# EAGLE schematic mb808909seq1.9 (EAGLE 6.5.0)
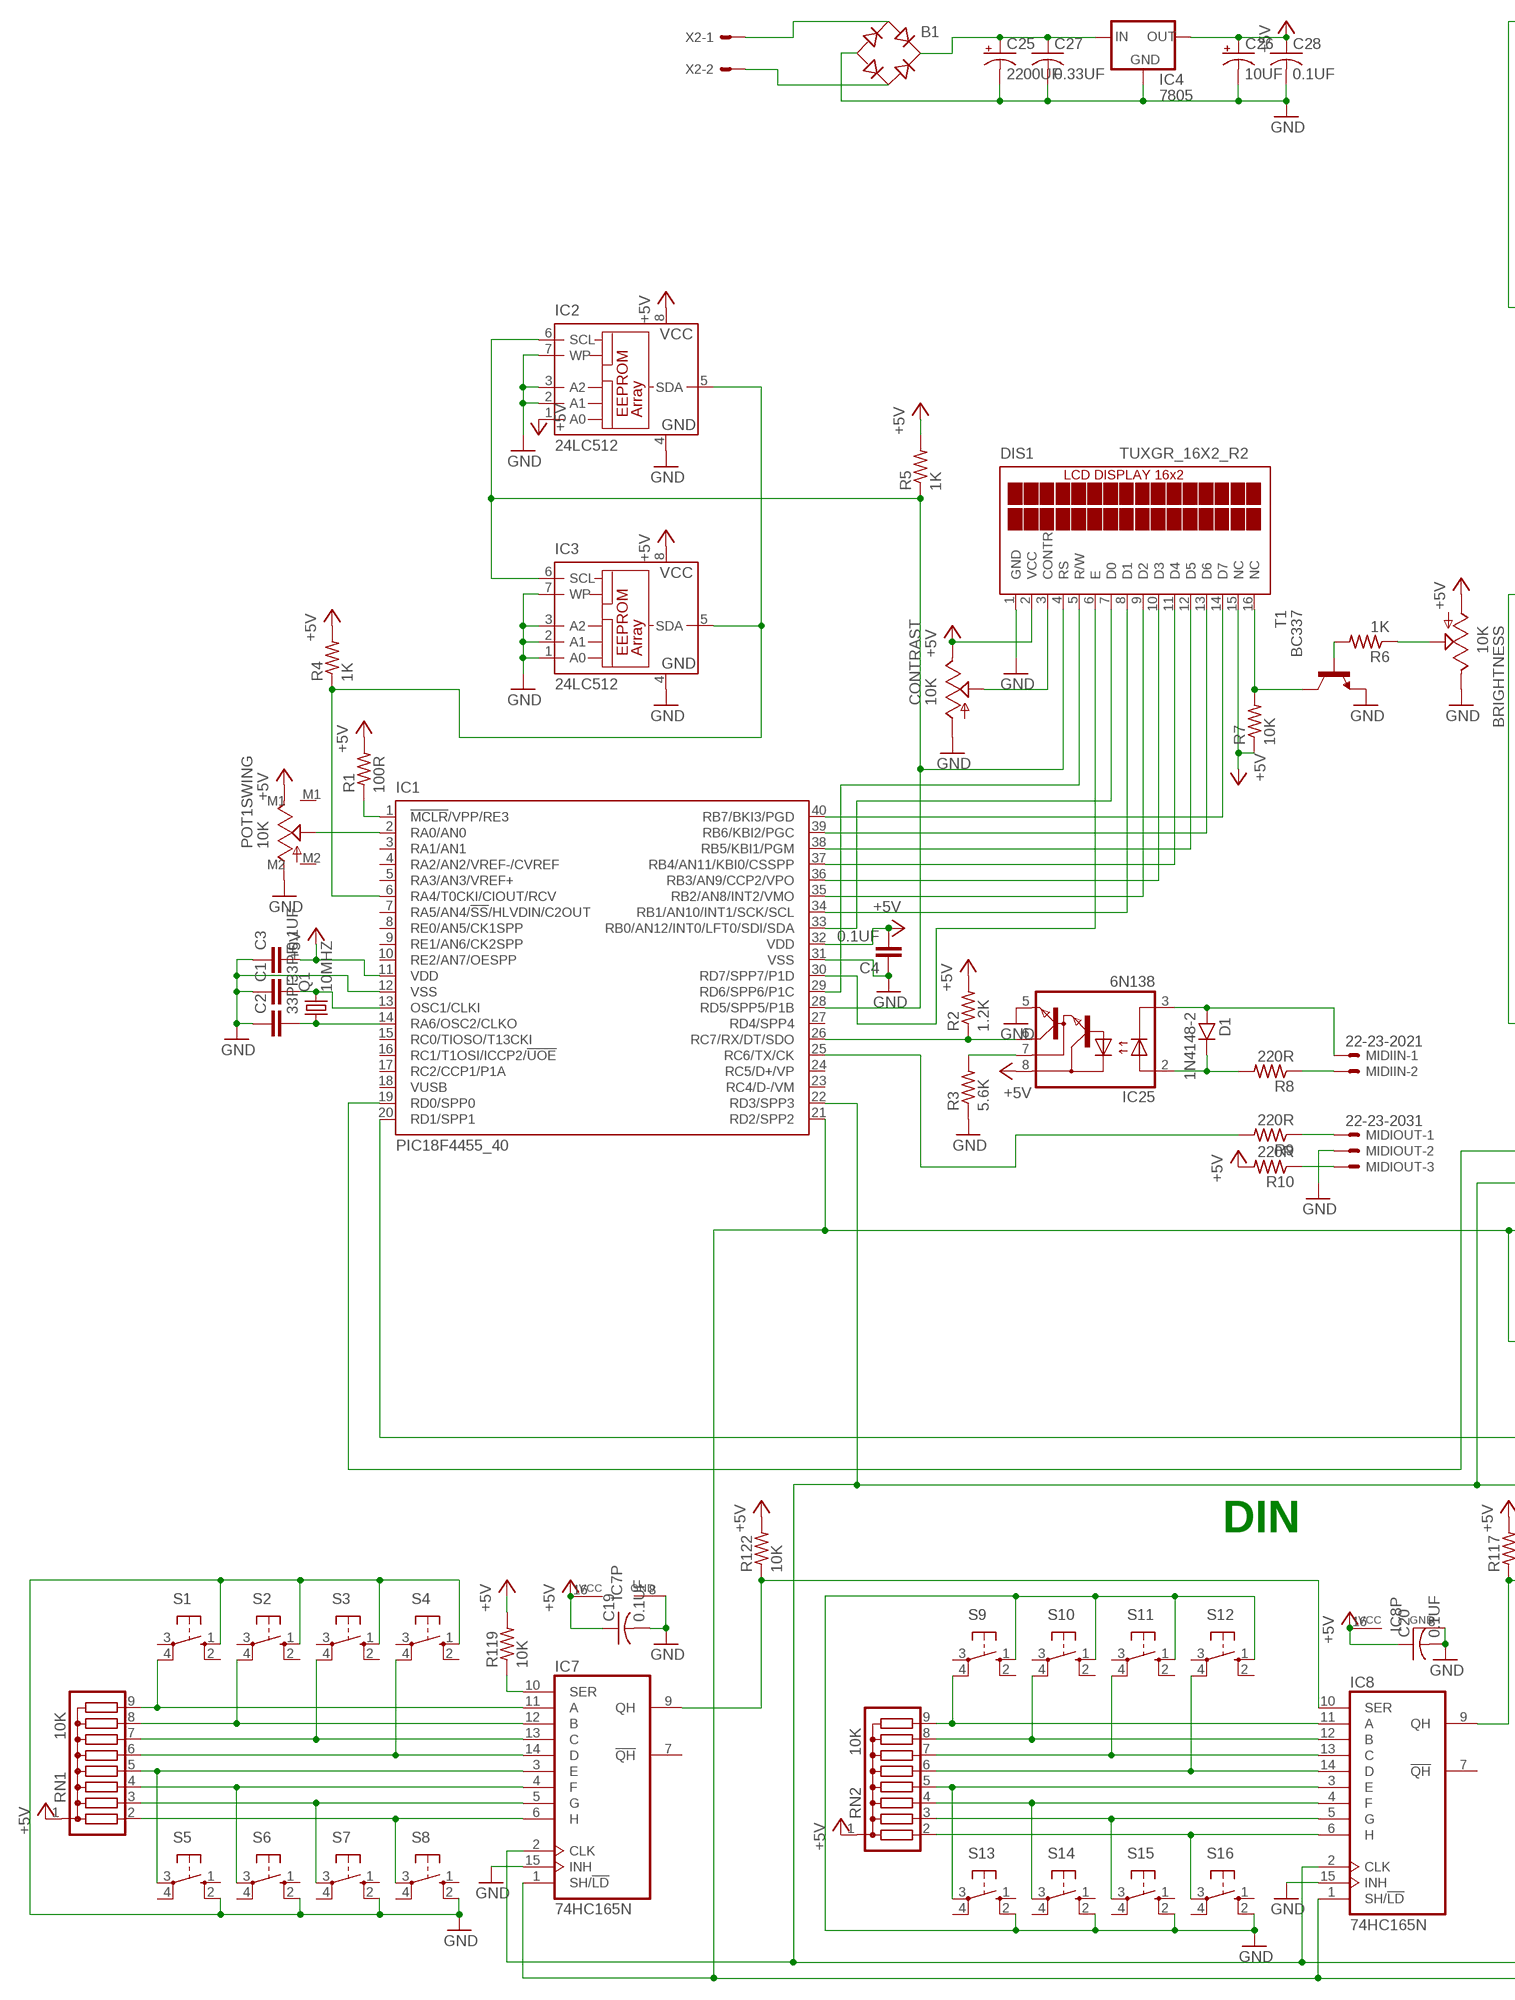
[diagram p0: schematic, sheet 1, part 1 of 2]
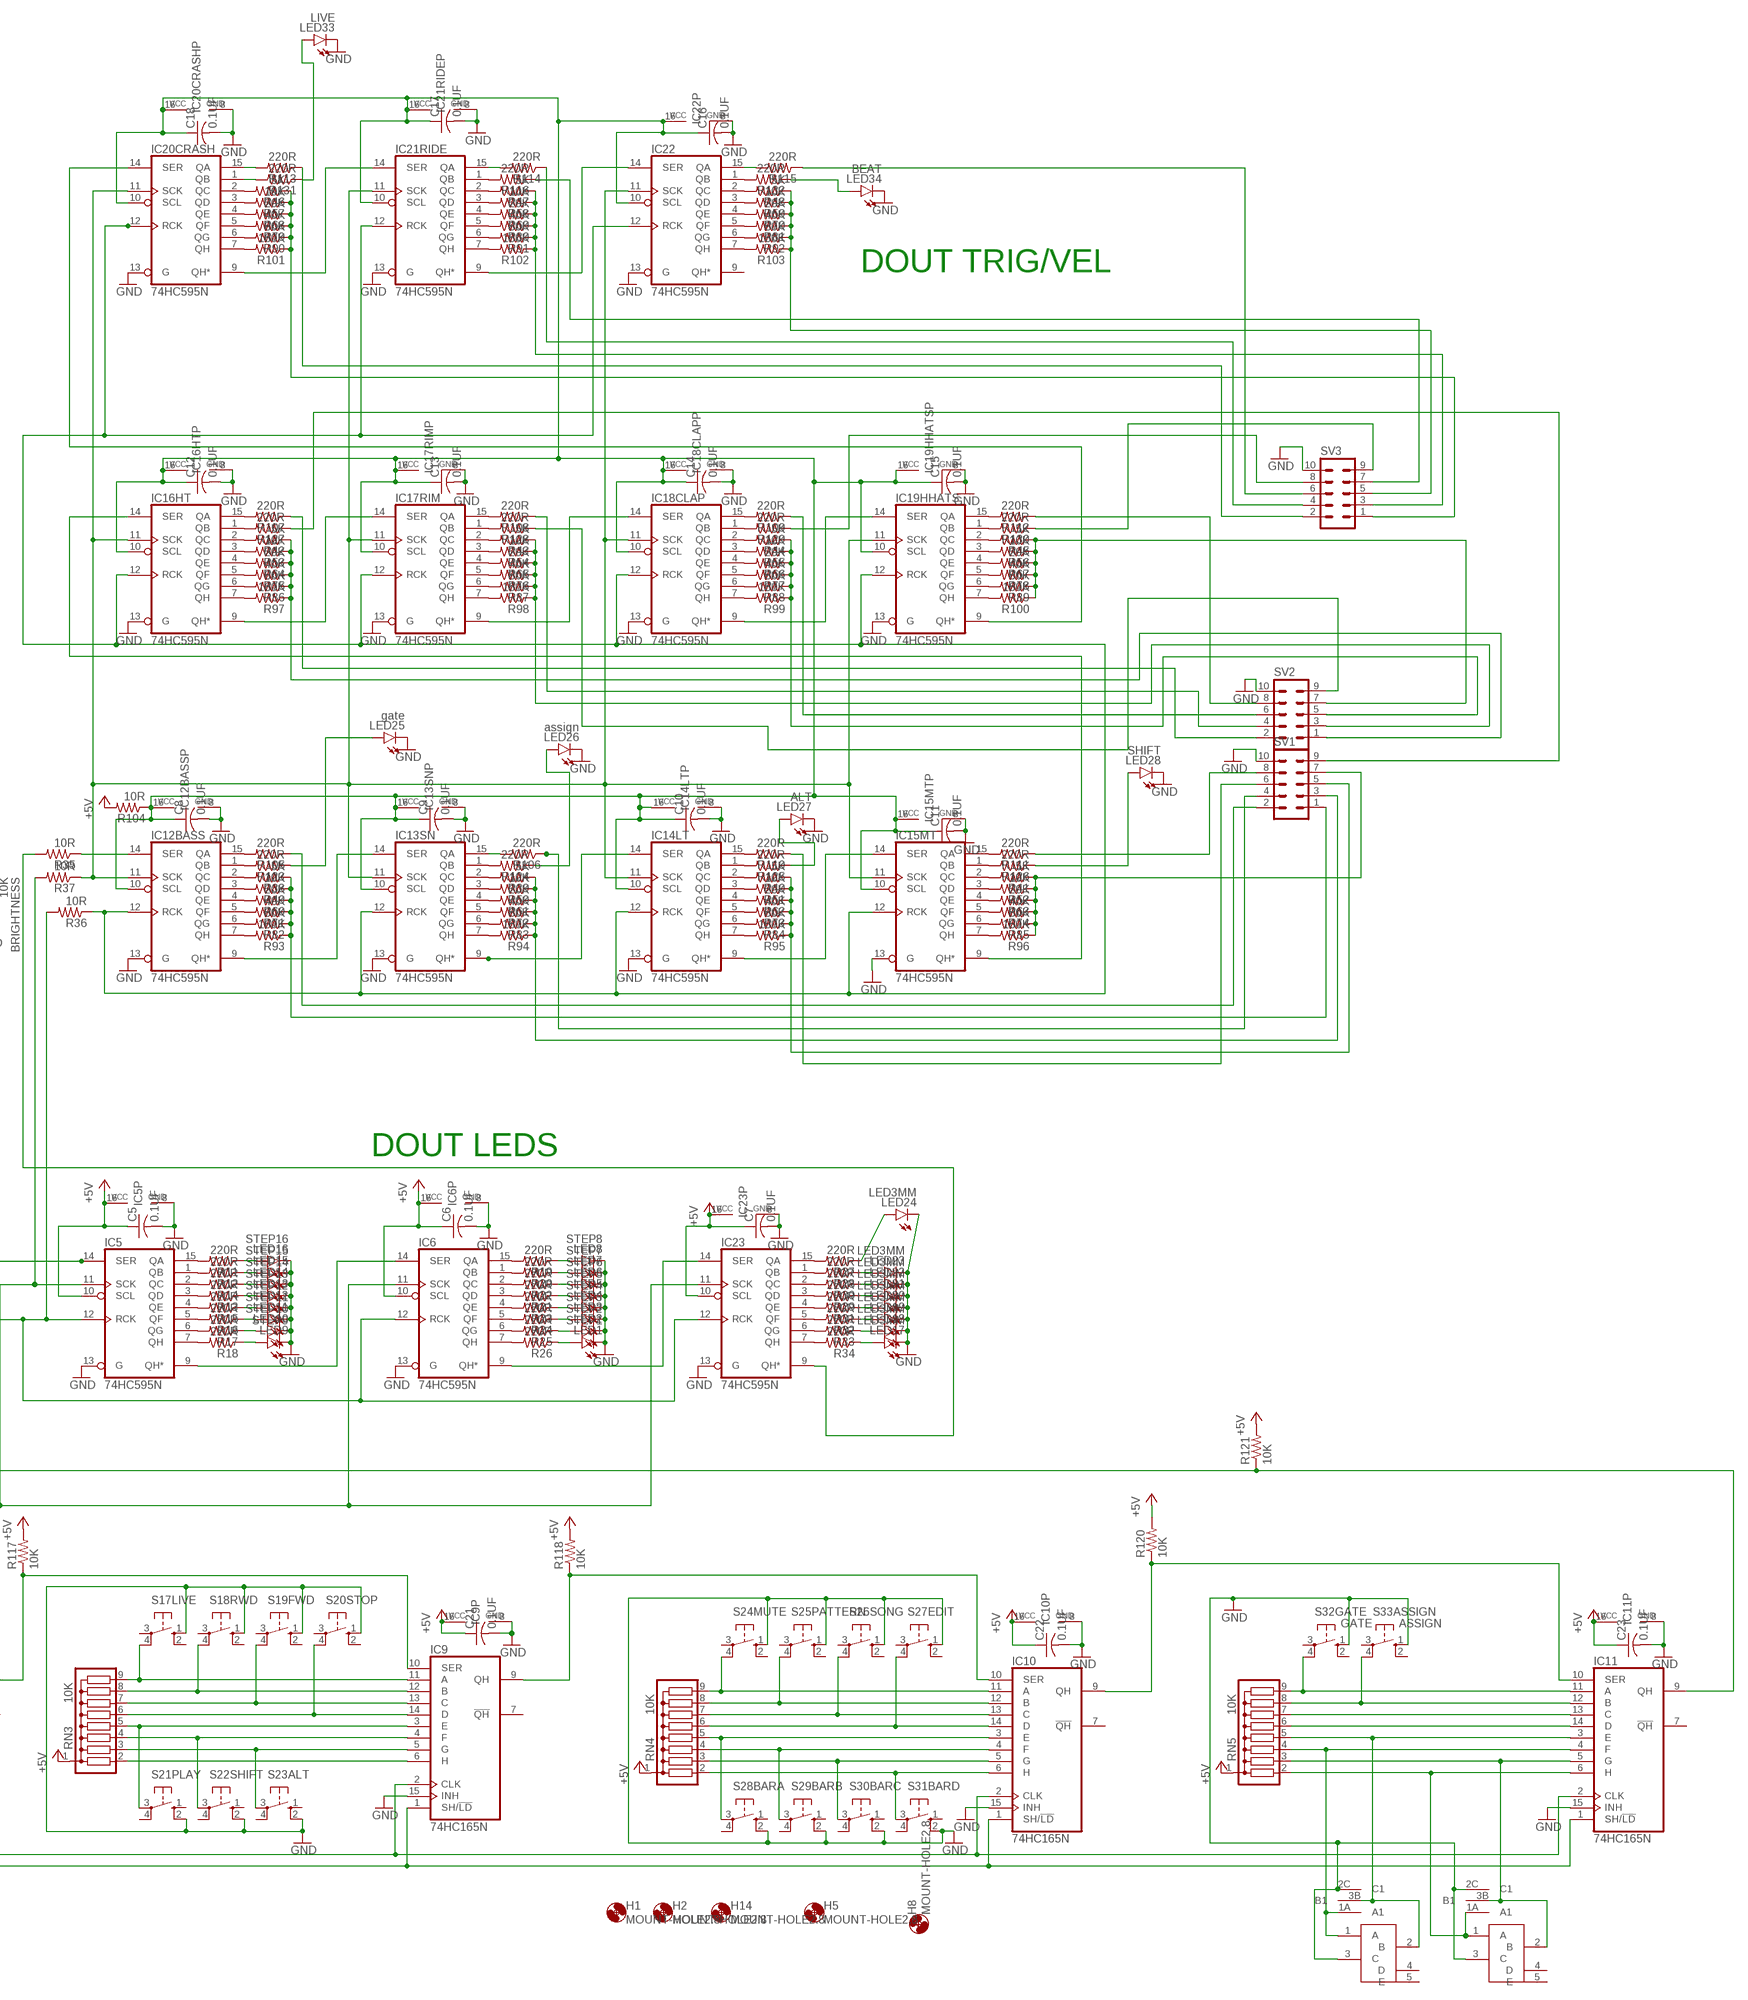
[diagram p1: schematic, sheet 1, part 2 of 2]

## Parts
B1  RB1A  [RB1A]
BRIGHTNESS  10K  TRIM_US-CA6V  [CA6V]
C1  33PF  050X030_0251  [050X030_025]
C2  33PF  050X030_0251  [050X030_025]
C3  0.1UF  050X030_0252  [050X030_025_2]
C4  0.1UF  050X030_0252  [050X030_025_2]
C5  0.1UF  C-US025-025X050  [C025-025X050]
C6  0.1UF  C-US025-025X050  [C025-025X050]
C7  0.1UF  C-US025-025X050  [C025-025X050]
C8  0.1UF  C-US025-025X050  [C025-025X050]
C9  0.1UF  C-US025-025X050  [C025-025X050]
C10  0.1UF  C-US025-025X050  [C025-025X050]
C11  0.1UF  C-US025-025X050  [C025-025X050]
C12  0.1UF  C-US025-025X050  [C025-025X050]
C13  0.1UF  C-US025-025X050  [C025-025X050]
C14  0.1UF  C-US025-025X050  [C025-025X050]
C15  0.1UF  C-US025-025X050  [C025-025X050]
C16  0.1UF  C-US025-025X050  [C025-025X050]
C17  0.1UF  C-US025-025X050  [C025-025X050]
C18  0.1UF  C-US025-025X050  [C025-025X050]
C19  0.1UF  C-US025-025X050  [C025-025X050]
C20  0.1UF  C-US025-025X050  [C025-025X050]
C21  0.1UF  C-US025-025X050  [C025-025X050]
C22  0.1UF  C-US025-025X050  [C025-025X050]
C23  0.1UF  C-US025-025X050  [C025-025X050]
C25  2200UF  CPOL-USE5-13  [E5-13]
C26  10UF  CPOL-USE2.5-5  [E2,5-5]
C27  0.33UF  C-US050-035X075  [C050-035X075]
C28  0.1UF  C-US025-025X050  [C025-025X050]
CONTRAST  10K  TRIM_US-CA6V  [CA6V]
D1  1N4148-2  [DO35-2]
DIS1  TUXGR_16X2_R2  [TUXGR_16X2_R2]
ENC1  instrument select  808_SNAPIN-ENCODER2  [808_SNAPIN]
ENC2  tempo  808_SNAPIN-ENCODER2  [808_SNAPIN]
H1  MOUNT-HOLE2.8  [2,8]
H2  MOUNT-HOLE2.8  [2,8]
H5  MOUNT-HOLE2.8  [2,8]
H8  MOUNT-HOLE2.8  [2,8]
H14  MOUNT-HOLE2.8  [2,8]
IC1  PIC18F4455_40  [DIL40]
IC2  24LC512  24C04P  [DIL8]
IC3  24LC512  24C04P  [DIL8]
IC4  7805  78XXS  [78XXS]
IC5  74HC595N  [DIL16]
IC6  74HC595N  [DIL16]
IC7  74HC165N  [DIL16]
IC8  74HC165N  [DIL16]
IC9  74HC165N  [DIL16]
IC10  74HC165N  [DIL16]
IC11  74HC165N  [DIL16]
IC12BASS  74HC595N  [DIL16]
IC13SN  74HC595N  [DIL16]
IC14LT  74HC595N  [DIL16]
IC15MT  74HC595N  [DIL16]
IC16HT  74HC595N  [DIL16]
IC17RIM  74HC595N  [DIL16]
IC18CLAP  74HC595N  [DIL16]
IC19HHATS  74HC595N  [DIL16]
IC20CRASH  74HC595N  [DIL16]
IC21RIDE  74HC595N  [DIL16]
IC22  74HC595N  [DIL16]
IC23  74HC595N  [DIL16]
IC25  6N138  [DIL08]
LED1  STEP1  LED3MM  [LED3MM]
LED2  STEP2  LED3MM  [LED3MM]
LED3  STEP3  LED3MM  [LED3MM]
LED4  STEP4  LED3MM  [LED3MM]
LED5  STEP5  LED3MM  [LED3MM]
LED6  STEP6  LED3MM  [LED3MM]
LED7  STEP7  LED3MM  [LED3MM]
LED8  STEP8  LED3MM  [LED3MM]
LED9  STEP9  LED3MM  [LED3MM]
LED10  STEP10  LED3MM  [LED3MM]
LED11  STEP11  LED3MM  [LED3MM]
LED12  STEP12  LED3MM  [LED3MM]
LED13  STEP13  LED3MM  [LED3MM]
LED14  STEP14  LED3MM  [LED3MM]
LED15  STEP15  LED3MM  [LED3MM]
LED16  STEP16  LED3MM  [LED3MM]
LED17  LED3MM  [LED3MM]
LED18  LED3MM  [LED3MM]
LED19  LED3MM  [LED3MM]
LED20  LED3MM  [LED3MM]
LED21  LED3MM  [LED3MM]
LED22  LED3MM  [LED3MM]
LED23  LED3MM  [LED3MM]
LED24  LED3MM  [LED3MM]
LED25  gate  LED3MM  [LED3MM]
LED26  assign  LED3MM  [LED3MM]
LED27  ALT  LED3MM  [LED3MM]
LED28  SHIFT  LED3MM  [LED3MM]
LED33  LIVE  LED3MM  [LED3MM]
LED34  BEAT  LED3MM  [LED3MM]
MIDIIN  22-23-2021  [22-23-2021]
MIDIOUT  22-23-2031  [22-23-2031]
POT1SWING  10K  303PARTS_POTEVU  [303PARTS_EVU]
Q1  10MHZ  CRYSTALHC18U-V  [HC18U-V]
R1  100R  6MM.3  [R0207/3]
R2  1.2K  6MM.3  [R0207/3]
R3  5.6K  6MM.3  [R0207/3]
R4  1K  6MM.3  [R0207/3]
R5  1K  6MM.3  [R0207/3]
R6  1K  6MM.3  [R0207/3]
R7  10K  6MM.3  [R0207/3]
R8  220R  6MM.3  [R0207/3]
R9  220R  6MM.3  [R0207/3]
R10  220R  6MM.3  [R0207/3]
R11  220R  6MM.3  [R0207/3]
R12  220R  6MM.3  [R0207/3]
R13  220R  6MM.3  [R0207/3]
R14  220R  6MM.3  [R0207/3]
R15  220R  6MM.3  [R0207/3]
R16  220R  6MM.3  [R0207/3]
R17  220R  6MM.3  [R0207/3]
R18  220R  6MM.3  [R0207/3]
R19  220R  6MM.3  [R0207/3]
R20  220R  6MM.3  [R0207/3]
R21  220R  6MM.3  [R0207/3]
R22  220R  6MM.3  [R0207/3]
R23  220R  6MM.3  [R0207/3]
R24  220R  6MM.3  [R0207/3]
R25  220R  6MM.3  [R0207/3]
R26  220R  6MM.3  [R0207/3]
R27  220R  6MM.3  [R0207/3]
R28  220R  6MM.3  [R0207/3]
R29  220R  6MM.3  [R0207/3]
R30  220R  6MM.3  [R0207/3]
R31  220R  6MM.3  [R0207/3]
R32  220R  6MM.3  [R0207/3]
R33  220R  6MM.3  [R0207/3]
R34  220R  6MM.3  [R0207/3]
R35  10R  6MM.3  [R0207/3]
R36  10R  6MM.3  [R0207/3]
R37  10R  6MM.3  [R0207/3]
R38  5K  6MM.3  [R0207/3]
R39  5K  6MM.3  [R0207/3]
R40  5K  6MM.3  [R0207/3]
R41  5K  6MM.3  [R0207/3]
R42  5K  6MM.3  [R0207/3]
R43  5K  6MM.3  [R0207/3]
R44  5K  6MM.3  [R0207/3]
R45  5K  6MM.3  [R0207/3]
R46  5K  6MM.3  [R0207/3]
R47  5K  6MM.3  [R0207/3]
R48  5K  6MM.3  [R0207/3]
R49  10K  6MM.3  [R0207/3]
R50  10K  6MM.3  [R0207/3]
R51  10K  6MM.3  [R0207/3]
R52  10K  6MM.3  [R0207/3]
R53  10K  6MM.3  [R0207/3]
R54  10K  6MM.3  [R0207/3]
R55  10K  6MM.3  [R0207/3]
R56  10K  6MM.3  [R0207/3]
R57  10K  6MM.3  [R0207/3]
R58  10K  6MM.3  [R0207/3]
R59  10K  6MM.3  [R0207/3]
R60  20K  6MM.3  [R0207/3]
R61  20K  6MM.3  [R0207/3]
R62  20K  6MM.3  [R0207/3]
R63  20K  6MM.3  [R0207/3]
R64  20K  6MM.3  [R0207/3]
R65  20K  6MM.3  [R0207/3]
R66  20K  6MM.3  [R0207/3]
R67  20K  6MM.3  [R0207/3]
R68  20K  6MM.3  [R0207/3]
R69  20K  6MM.3  [R0207/3]
R70  20K  6MM.3  [R0207/3]
R71  40K  6MM.3  [R0207/3]
R72  40K  6MM.3  [R0207/3]
R73  40K  6MM.3  [R0207/3]
R74  40K  6MM.3  [R0207/3]
R75  40K  6MM.3  [R0207/3]
R76  40K  6MM.3  [R0207/3]
R77  40K  6MM.3  [R0207/3]
R78  40K  6MM.3  [R0207/3]
R79  40K  6MM.3  [R0207/3]
R80  40K  6MM.3  [R0207/3]
R81  40K  6MM.3  [R0207/3]
R82  80K  6MM.3  [R0207/3]
R83  80K  6MM.3  [R0207/3]
R84  80K  6MM.3  [R0207/3]
R85  80K  6MM.3  [R0207/3]
R86  80K  6MM.3  [R0207/3]
R87  80K  6MM.3  [R0207/3]
R88  80K  6MM.3  [R0207/3]
R89  80K  6MM.3  [R0207/3]
R90  80K  6MM.3  [R0207/3]
R91  80K  6MM.3  [R0207/3]
R92  80K  6MM.3  [R0207/3]
R93  160K  6MM.3  [R0207/3]
R94  160K  6MM.3  [R0207/3]
R95  160K  6MM.3  [R0207/3]
R96  160K  6MM.3  [R0207/3]
R97  160K  6MM.3  [R0207/3]
R98  160K  6MM.3  [R0207/3]
R99  160K  6MM.3  [R0207/3]
R100  160K  6MM.3  [R0207/3]
R101  160K  6MM.3  [R0207/3]
R102  160K  6MM.3  [R0207/3]
R103  160K  6MM.3  [R0207/3]
R104  10R  6MM.3  [R0207/3]
R105  220R  6MM.3  [R0207/3]
R106  220R  6MM.3  [R0207/3]
R107  220R  6MM.3  [R0207/3]
R108  220R  6MM.3  [R0207/3]
R109  220R  6MM.3  [R0207/3]
R110  220R  6MM.3  [R0207/3]
R111  220R  6MM.3  [R0207/3]
R112  220R  6MM.3  [R0207/3]
R113  220R  6MM.3  [R0207/3]
R114  220R  6MM.3  [R0207/3]
R115  220R  6MM.3  [R0207/3]
R116  220R  6MM.3  [R0207/3]
R117  10K  6MM.3  [R0207/3]
R118  10K  6MM.3  [R0207/3]
R119  10K  6MM.3  [R0207/3]
R120  10K  6MM.3  [R0207/3]
R121  10K  6MM.3  [R0207/3]
R122  10K  6MM.3  [R0207/3]
R123  220R  6MM.3  [R0207/3]
R124  220R  6MM.3  [R0207/3]
R125  220R  6MM.3  [R0207/3]
R126  220R  6MM.3  [R0207/3]
R127  220R  6MM.3  [R0207/3]
R128  220R  6MM.3  [R0207/3]
R129  220R  6MM.3  [R0207/3]
R130  220R  6MM.3  [R0207/3]
R131  220R  6MM.3  [R0207/3]
R132  220R  6MM.3  [R0207/3]
RN1  10K  G08R  [SIL9]
RN2  10K  G08R  [SIL9]
RN3  10K  G08R  [SIL9]
RN4  10K  G08R  [SIL9]
RN5  10K  G08R  [SIL9]
S1  SWITCH-OMRON_40-XX  [SWITCH-OMRON_B3F-40XX]
S2  SWITCH-OMRON_40-XX  [SWITCH-OMRON_B3F-40XX]
S3  SWITCH-OMRON_40-XX  [SWITCH-OMRON_B3F-40XX]
S4  SWITCH-OMRON_40-XX  [SWITCH-OMRON_B3F-40XX]
S5  SWITCH-OMRON_40-XX  [SWITCH-OMRON_B3F-40XX]
S6  SWITCH-OMRON_40-XX  [SWITCH-OMRON_B3F-40XX]
S7  SWITCH-OMRON_40-XX  [SWITCH-OMRON_B3F-40XX]
S8  SWITCH-OMRON_40-XX  [SWITCH-OMRON_B3F-40XX]
S9  SWITCH-OMRON_40-XX  [SWITCH-OMRON_B3F-40XX]
S10  SWITCH-OMRON_40-XX  [SWITCH-OMRON_B3F-40XX]
S11  SWITCH-OMRON_40-XX  [SWITCH-OMRON_B3F-40XX]
S12  SWITCH-OMRON_40-XX  [SWITCH-OMRON_B3F-40XX]
S13  SWITCH-OMRON_40-XX  [SWITCH-OMRON_B3F-40XX]
S14  SWITCH-OMRON_40-XX  [SWITCH-OMRON_B3F-40XX]
S15  SWITCH-OMRON_40-XX  [SWITCH-OMRON_B3F-40XX]
S16  SWITCH-OMRON_40-XX  [SWITCH-OMRON_B3F-40XX]
S17LIVE  SWITCH-OMRON_40-XX  [SWITCH-OMRON_B3F-40XX]
S18RWD  SWITCH-OMRON_40-XX  [SWITCH-OMRON_B3F-40XX]
S19FWD  SWITCH-OMRON_40-XX  [SWITCH-OMRON_B3F-40XX]
S20STOP  SWITCH-OMRON_40-XX  [SWITCH-OMRON_B3F-40XX]
S21PLAY  SWITCH-OMRON_40-XX  [SWITCH-OMRON_B3F-40XX]
S22SHIFT  SWITCH-OMRON_40-XX  [SWITCH-OMRON_B3F-40XX]
S23ALT  SWITCH-OMRON_40-XX  [SWITCH-OMRON_B3F-40XX]
S24MUTE  SWITCH-OMRON_40-XX  [SWITCH-OMRON_B3F-40XX]
S25PATTERN  SWITCH-OMRON_40-XX  [SWITCH-OMRON_B3F-40XX]
S26SONG  SWITCH-OMRON_40-XX  [SWITCH-OMRON_B3F-40XX]
S27EDIT  SWITCH-OMRON_40-XX  [SWITCH-OMRON_B3F-40XX]
S28BARA  SWITCH-OMRON_40-XX  [SWITCH-OMRON_B3F-40XX]
S29BARB  SWITCH-OMRON_40-XX  [SWITCH-OMRON_B3F-40XX]
S30BARC  SWITCH-OMRON_40-XX  [SWITCH-OMRON_B3F-40XX]
S31BARD  SWITCH-OMRON_40-XX  [SWITCH-OMRON_B3F-40XX]
S32GATE  GATE  SWITCH-OMRON_40-XX  [SWITCH-OMRON_B3F-40XX]
S33ASSIGN  ASSIGN  SWITCH-OMRON_40-XX  [SWITCH-OMRON_B3F-40XX]
SV1  MA05-2  [MA05-2]
SV2  MA05-2  [MA05-2]
SV3  MA05-2  [MA05-2]
T1  BC337  BC372-NPN-TO92-CBE  [TO92-CBE]
X2  KK-156-2  [KK-156-2]

## Nets
+5ANALOG: C8.1 C9.1 C10.1 C11.1 C12.1 C13.1 C14.1 C15.1 C16.1 C17.1 C18.1 IC12BASS.10(SCL) IC12BASS.16(VCC) IC13SN.10(SCL) IC13SN.16(VCC) IC14LT.10(SCL) IC14LT.16(VCC) IC15MT.10(SCL) IC15MT.16(VCC) IC16HT.10(SCL) IC16HT.16(VCC) IC17RIM.10(SCL) IC17RIM.16(VCC) IC18CLAP.10(SCL) IC18CLAP.16(VCC) IC19HHATS.10(SCL) IC19HHATS.16(VCC) IC20CRASH.10(SCL) IC20CRASH.16(VCC) IC21RIDE.10(SCL) IC21RIDE.16(VCC) IC22.10(SCL) IC22.16(VCC) R104.1
+5V [5V]: BRIGHTNESS.A C3.2 C4.2 C5.1 C6.1 C7.1 C19.1 C20.1 C21.1 C22.1 C23.1 C26.+ C28.1 CONTRAST.E DIS1.2(VCC) DIS1.15(NC) IC1.11(VDD) IC1.32(VDD) IC2.1(A0) IC2.8(VCC) IC3.8(VCC) IC4.OUT IC5.10(SCL) IC5.16(VCC) IC6.10(SCL) IC6.16(VCC) IC7.16(VCC) IC8.16(VCC) IC9.16(VCC) IC10.16(VCC) IC11.16(VCC) IC23.10(SCL) IC23.16(VCC) IC25.8(VCC) POT1SWING.3(E) R1.2 R2.2 R4.2 R5.2 R7.1 R10.2 R104.2 R117.2 R118.2 R119.2 R120.2 R121.2 R122.2 RN1.1 RN2.1 RN3.1 RN4.1 RN5.1
BD: R105.1 SV1.2
CB: R113.1 SV3.2
CP: R108.1 SV2.4
CV_DOUT_SR1: R38.1 R49.1 R60.1 R71.1 R82.1 R93.1 SV1.1
CV_DOUT_SR2: R39.1 R50.1 R61.1 R72.1 R83.1 R94.1 SV1.3
CV_DOUT_SR3: R40.1 R51.1 R62.1 R73.1 R84.1 R95.1 SV1.5
CV_DOUT_SR4: R41.1 R52.1 R63.1 R74.1 R85.1 R96.1 SV1.7
CV_DOUT_SR5: R42.1 R53.1 R64.1 R75.1 R86.1 R97.1 SV2.1
CV_DOUT_SR6: R43.1 R54.1 R65.1 R76.1 R87.1 R98.1 SV2.3
CV_DOUT_SR7: R44.1 R55.1 R66.1 R77.1 R88.1 R99.1 SV2.5
CV_DOUT_SR8: R45.1 R56.1 R67.1 R78.1 R89.1 R100.1 SV2.7
CV_DOUT_SR9: R46.1 R57.1 R68.1 R79.1 R90.1 R101.1 SV3.1
CV_DOUT_SR10: R47.1 R58.1 R69.1 R80.1 R91.1 R102.1 SV3.3
CV_DOUT_SR11: R48.1 R59.1 R70.1 R81.1 R92.1 R103.1 SV3.5
CY: R114.1 SV3.4
EXT.1: R127.1 SV1.9
EXT.2: R128.1 SV2.9
EXT.3: R129.1 SV3.8
EXT.4: R130.1 SV3.9
GND [gnd]: B1.- BRIGHTNESS.E C1.1 C2.1 C3.1 C4.1 C5.2 C6.2 C7.2 C8.2 C9.2 C10.2 C11.2 C12.2 C13.2 C14.2 C15.2 C16.2 C17.2 C18.2 C19.2 C20.2 C21.2 C22.2 C23.2 C25.- C26.- C27.2 C28.2 CONTRAST.A DIS1.1(GND) ENC1.2C(C1) ENC1.3(C) ENC2.2C(C1) ENC2.3(C) IC1.12(VSS) IC1.31(VSS) IC2.2(A1) IC2.3(A2) IC2.4(GND) IC2.7(WP) IC3.1(A0) IC3.2(A1) IC3.3(A2) IC3.4(GND) IC3.7(WP) IC4.GND IC5.8(GND) IC5.13(G) IC6.8(GND) IC6.13(G) IC7.8(GND) IC7.15(INH) IC8.8(GND) IC8.15(INH) IC9.8(GND) IC9.15(INH) IC10.8(GND) IC10.15(INH) IC11.8(GND) IC11.15(INH) IC12BASS.8(GND) IC12BASS.13(G) IC13SN.8(GND) IC13SN.13(G) IC14LT.8(GND) IC14LT.13(G) IC15MT.8(GND) IC15MT.13(G) IC16HT.8(GND) IC16HT.13(G) IC17RIM.8(GND) IC17RIM.13(G) IC18CLAP.8(GND) IC18CLAP.13(G) IC19HHATS.8(GND) IC19HHATS.13(G) IC20CRASH.8(GND) IC20CRASH.13(G) IC21RIDE.8(GND) IC21RIDE.13(G) IC22.8(GND) IC22.13(G) IC23.8(GND) IC23.13(G) IC25.5(GND) LED1.K(C) LED2.K(C) LED3.K(C) LED4.K(C) LED5.K(C) LED6.K(C) LED7.K(C) LED8.K(C) LED9.K(C) LED10.K(C) LED11.K(C) LED12.K(C) LED13.K(C) LED14.K(C) LED15.K(C) LED16.K(C) LED17.K(C) LED18.K(C) LED19.K(C) LED20.K(C) LED21.K(C) LED22.K(C) LED23.K(C) LED24.K(C) LED25.K(C) LED26.K(C) LED27.K(C) LED28.K(C) LED33.K(C) LED34.K(C) MIDIOUT.2 POT1SWING.1(A) R3.1 S1.1(S) S2.1(S) S3.1(S) S4.1(S) S5.2(S1) S6.2(S1) S7.2(S1) S8.2(S1) S9.1(S) S10.1(S) S11.1(S) S12.1(S) S13.2(S1) S14.2(S1) S15.2(S1) S16.2(S1) S17LIVE.1(S) S18RWD.1(S) S19FWD.1(S) S20STOP.1(S) S21PLAY.2(S1) S22SHIFT.2(S1) S23ALT.2(S1) S24MUTE.1(S) S25PATTERN.1(S) S26SONG.1(S) S27EDIT.1(S) S28BARA.2(S1) S29BARB.2(S1) S30BARC.2(S1) S31BARD.2(S1) S32GATE.1(S) S33ASSIGN.1(S) SV1.10 SV2.10 SV3.10 T1.E
HHATSELECT: R116.1 SV3.7
HT/HC: R107.1 SV2.2
LT/LC: R110.1 SV1.6
MA: R109.1 SV2.6
MT/MC: R111.1 SV1.8
N$1: C1.2 IC1.13(OSC1/CLKI) Q1.2
N$2: C2.2 IC1.14(RA6/OSC2/CLKO) Q1.1
N$3: IC25.7(VB) R3.2
N$4: IC9.14(D) RN3.6 S20STOP.4(P1)
N$5: IC1.2(RA0/AN0) POT1SWING.2(S)
N$6: IC1.1(!MCLR!/VPP/RE3) R1.1
N$7: IC1.26(RC7/RX/DT/SDO) IC25.6(VO) R2.1
N$8: D1.A IC25.3(C) MIDIIN.1
N$9: D1.C IC25.2(A) R8.2
N$10: MIDIOUT.3 R10.1
N$11: IC1.25(RC6/TX/CK) R9.2
N$12: MIDIOUT.1 R9.1
N$13: MIDIIN.2 R8.1
N$14: DIS1.4(RS) IC1.28(RD5/SPP5/P1B) IC2.6(SCL) IC3.6(SCL) R5.1
N$15: IC1.6(RA4/T0CKI/CIOUT/RCV) IC2.5(SDA) IC3.5(SDA) R4.1
N$16: DIS1.14(D7) IC1.40(RB7/BKI3/PGD)
N$17: DIS1.13(D6) IC1.39(RB6/KBI2/PGC)
N$18: DIS1.12(D5) IC1.38(RB5/KBI1/PGM)
N$19: DIS1.11(D4) IC1.37(RB4/AN11/KBI0/CSSPP)
N$20: DIS1.10(D3) IC1.36(RB3/AN9/CCP2/VPO)
N$21: DIS1.9(D2) IC1.35(RB2/AN8/INT2/VMO)
N$22: DIS1.8(D1) IC1.34(RB1/AN10/INT1/SCK/SCL)
N$23: DIS1.7(D0) IC1.33(RB0/AN12/INT0/LFT0/SDI/SDA)
N$24: DIS1.6(E) IC1.30(RD7/SPP7/P1D)
N$25: DIS1.5(R/W) IC1.29(RD6/SPP6/P1C)
N$26: CONTRAST.S DIS1.3(CONTR)
N$27: IC5.15(QA) R11.2
N$28: DIS1.16(NC) R7.2 T1.C
N$29: IC5.1(QB) R12.2
N$30: R6.2 T1.B
N$31: BRIGHTNESS.S R6.1
N$32: IC5.3(QD) R13.2
N$33: IC5.2(QC) R14.2
N$34: IC5.4(QE) R15.2
N$35: IC5.5(QF) R16.2
N$36: IC5.6(QG) R17.2
N$37: IC5.7(QH) R18.2
N$38: LED15.A R12.1
N$39: LED13.A R13.1
N$40: LED16.A R11.1
N$41: LED14.A R14.1
N$42: LED12.A R15.1
N$43: LED11.A R16.1
N$44: LED10.A R17.1
N$45: LED9.A R18.1
N$47: LED8.A R19.1
N$48: LED6.A R22.1
N$49: LED7.A R20.1
N$50: LED5.A R21.1
N$51: LED4.A R23.1
N$52: LED3.A R24.1
N$53: LED2.A R25.1
N$54: LED1.A R26.1
N$55: ENC2.2(B) ENC2.3B(B1) IC11.5(G) RN5.3
N$56: IC6.15(QA) R19.2
N$57: IC6.1(QB) R20.2
N$58: IC6.2(QC) R22.2
N$59: IC6.3(QD) R21.2
N$60: IC6.4(QE) R23.2
N$61: IC6.5(QF) R24.2
N$62: IC6.6(QG) R25.2
N$63: IC6.7(QH) R26.2
N$64: IC5.9(QH*) IC6.14(SER)
N$65: IC6.9(QH*) IC23.14(SER)
N$66: LED24.A R27.1
N$67: LED22.A R30.1
N$68: LED23.A R28.1
N$69: LED21.A R29.1
N$70: LED20.A R31.1
N$71: LED19.A R32.1
N$72: LED18.A R33.1
N$73: LED17.A R34.1
N$74: IC12BASS.2(QC) R38.2
N$75: IC23.15(QA) R27.2
N$76: IC23.1(QB) R28.2
N$77: IC23.3(QD) R29.2
N$78: IC23.2(QC) R30.2
N$79: IC23.4(QE) R31.2
N$80: IC23.5(QF) R32.2
N$81: IC23.6(QG) R33.2
N$82: IC23.7(QH) R34.2
N$83: IC7.5(G) RN1.3 S7.3(P)
N$84: IC12BASS.3(QD) R49.2
N$85: IC12BASS.4(QE) R60.2
N$86: IC7.4(F) RN1.4 S6.3(P)
N$87: IC8.14(D) RN2.6 S12.4(P1)
N$88: IC12BASS.5(QF) R71.2
N$89: IC12BASS.6(QG) R82.2
N$90: IC12BASS.7(QH) R93.2
N$91: IC7.14(D) RN1.6 S4.4(P1)
N$92: IC13SN.2(QC) R39.2
N$93: IC12BASS.14(SER) R35.1
N$94: IC13SN.3(QD) R50.2
N$95: IC7.13(C) RN1.7 S3.4(P1)
N$96: IC13SN.4(QE) R61.2
N$97: IC13SN.5(QF) R72.2
N$98: IC13SN.6(QG) R83.2
N$99: IC13SN.7(QH) R94.2
N$100: IC7.12(B) RN1.8 S2.4(P1)
N$101: IC13SN.9(QH*) IC14LT.14(SER)
N$102: IC8.5(G) RN2.3 S15.3(P)
N$103: IC21RIDE.1(QB) R116.2
N$104: IC14LT.2(QC) R40.2
N$105: IC14LT.3(QD) R51.2
N$106: IC14LT.4(QE) R62.2
N$107: IC14LT.5(QF) R73.2
N$108: IC14LT.6(QG) R84.2
N$109: IC14LT.7(QH) R95.2
N$110: IC8.6(H) RN2.2 S16.3(P)
N$111: IC15MT.2(QC) R41.2
N$112: IC15MT.3(QD) R52.2
N$113: IC15MT.4(QE) R63.2
N$114: IC15MT.5(QF) R74.2
N$115: IC15MT.6(QG) R85.2
N$116: IC15MT.7(QH) R96.2
N$117: B1.AC1 X2.1
N$118: IC15MT.9(QH*) IC16HT.14(SER)
N$119: B1.AC2 X2.2
N$120: B1.+ C25.+ C27.1 IC4.IN
N$121: IC16HT.2(QC) R42.2
N$122: IC16HT.3(QD) R53.2
N$123: IC16HT.4(QE) R64.2
N$124: IC16HT.5(QF) R75.2
N$125: IC16HT.6(QG) R86.2
N$126: IC16HT.7(QH) R97.2
N$127: ENC1.1(A) ENC1.1A(A1) IC11.4(F) RN5.4
N$128: IC17RIM.2(QC) R43.2
N$129: IC17RIM.3(QD) R54.2
N$130: IC17RIM.4(QE) R65.2
N$131: IC17RIM.5(QF) R76.2
N$132: IC17RIM.6(QG) R87.2
N$133: IC17RIM.7(QH) R98.2
N$134: IC8.13(C) RN2.7 S11.4(P1)
N$135: IC17RIM.9(QH*) IC18CLAP.14(SER)
N$136: IC8.12(B) RN2.8 S10.4(P1)
N$137: IC8.11(A) RN2.9 S9.4(P1)
N$138: IC18CLAP.2(QC) R44.2
N$139: IC18CLAP.3(QD) R55.2
N$140: IC18CLAP.4(QE) R66.2
N$141: IC18CLAP.5(QF) R77.2
N$142: IC18CLAP.6(QG) R88.2
N$143: IC18CLAP.7(QH) R99.2
N$144: IC7.3(E) RN1.5 S5.3(P)
N$145: IC19HHATS.2(QC) R45.2
N$146: IC19HHATS.3(QD) R56.2
N$147: IC19HHATS.4(QE) R67.2
N$148: IC19HHATS.5(QF) R78.2
N$149: IC19HHATS.6(QG) R89.2
N$150: IC19HHATS.7(QH) R100.2
N$151: IC9.6(H) RN3.2
N$152: IC19HHATS.9(QH*) IC20CRASH.14(SER)
N$153: IC9.5(G) RN3.3 S23ALT.3(P)
N$154: IC9.4(F) RN3.4 S22SHIFT.3(P)
N$155: IC20CRASH.2(QC) R46.2
N$156: IC20CRASH.3(QD) R57.2
N$157: IC20CRASH.4(QE) R68.2
N$158: IC20CRASH.5(QF) R79.2
N$159: IC20CRASH.6(QG) R90.2
N$160: IC20CRASH.7(QH) R101.2
N$161: IC9.3(E) RN3.5 S21PLAY.3(P)
N$162: IC21RIDE.2(QC) R47.2
N$163: IC21RIDE.3(QD) R58.2
N$164: IC21RIDE.4(QE) R69.2
N$165: IC21RIDE.5(QF) R80.2
N$166: IC21RIDE.6(QG) R91.2
N$167: IC21RIDE.7(QH) R102.2
N$168: IC7.6(H) RN1.2 S8.3(P)
N$169: IC21RIDE.9(QH*) IC22.14(SER)
N$170: IC9.13(C) RN3.7 S19FWD.4(P1)
N$171: IC9.12(B) RN3.8 S18RWD.4(P1)
N$172: IC22.2(QC) R48.2
N$173: IC22.3(QD) R59.2
N$174: IC22.4(QE) R70.2
N$175: IC22.5(QF) R81.2
N$176: IC22.6(QG) R92.2
N$177: IC22.7(QH) R103.2
N$178: IC9.11(A) RN3.9 S17LIVE.4(P1)
N$179: IC12BASS.9(QH*) IC13SN.14(SER)
N$180: IC12BASS.15(QA) R105.2
N$181: IC14LT.9(QH*) IC15MT.14(SER)
N$182: IC13SN.15(QA) R106.2
N$183: IC16HT.9(QH*) IC17RIM.14(SER)
N$184: IC16HT.15(QA) R107.2
N$185: IC18CLAP.9(QH*) IC19HHATS.14(SER)
N$186: IC17RIM.15(QA) R108.2
N$187: IC20CRASH.9(QH*) IC21RIDE.14(SER)
N$188: IC18CLAP.15(QA) R109.2
N$189: IC14LT.15(QA) R110.2
N$190: IC15MT.15(QA) R111.2
N$191: IC19HHATS.15(QA) R112.2
N$192: IC20CRASH.15(QA) R113.2
N$193: IC21RIDE.15(QA) R114.2
N$194: IC22.15(QA) R115.2
N$195: IC7.11(A) RN1.9 S1.4(P1)
N$196: IC10.6(H) RN4.2 S31BARD.3(P)
N$197: IC10.5(G) RN4.3 S30BARC.3(P)
N$198: IC10.4(F) RN4.4 S29BARB.3(P)
N$199: IC10.3(E) RN4.5 S28BARA.3(P)
N$200: IC10.14(D) RN4.6 S27EDIT.4(P1)
N$201: IC10.13(C) RN4.7 S26SONG.4(P1)
N$202: IC10.12(B) RN4.8 S25PATTERN.4(P1)
N$203: IC10.11(A) RN4.9 S24MUTE.4(P1)
N$204: ENC1.2(B) ENC1.3B(B1) IC11.3(E) RN5.5
N$205: IC7.9(QH) IC8.10(SER) R122.1
N$206: IC8.9(QH) IC9.10(SER) R117.1
N$207: IC9.9(QH) IC10.10(SER) R118.1
N$208: IC8.4(F) RN2.4 S14.3(P)
N$209: IC8.3(E) RN2.5 S13.3(P)
N$210: IC12BASS.1(QB) R123.2
N$211: IC11.14(D) RN5.6
N$212: IC11.13(C) RN5.7
N$213: IC11.12(B) RN5.8 S33ASSIGN.4(P1)
N$214: IC11.11(A) RN5.9 S32GATE.4(P1)
N$215: IC13SN.1(QB) R124.2
N$216: IC7.10(SER) R119.1
N$217: IC10.9(QH) IC11.10(SER) R120.1
N$218: IC14LT.1(QB) R125.2
N$219: IC15MT.1(QB) R126.2
N$220: IC16HT.1(QB) R127.2
N$221: IC17RIM.1(QB) R128.2
N$222: IC18CLAP.1(QB) R129.2
N$223: IC19HHATS.1(QB) R130.2
N$224: IC20CRASH.1(QB) R131.2
N$225: IC22.1(QB) R132.2
N$226: LED25.A R123.1
N$227: LED26.A R124.1
N$228: LED27.A R125.1
N$229: LED28.A R126.1
N$230: ENC2.1(A) ENC2.1A(A1) IC11.6(H) RN5.2
N$234: LED33.A R131.1
N$235: LED34.A R132.1
OH: R115.1 SV3.6
R0: IC1.19(RD0/SPP0) IC5.14(SER)
R8: IC23.9(QH*) R35.2
RCANALOG: IC12BASS.12(RCK) IC13SN.12(RCK) IC14LT.12(RCK) IC15MT.12(RCK) IC16HT.12(RCK) IC17RIM.12(RCK) IC18CLAP.12(RCK) IC19HHATS.12(RCK) IC20CRASH.12(RCK) IC21RIDE.12(RCK) IC22.12(RCK) R36.1
RCDIG1: IC1.21(RD2/SPP2) IC5.12(RCK) IC6.12(RCK) IC7.1(SH/!LD) IC8.1(SH/!LD) IC9.1(SH/!LD) IC10.1(SH/!LD) IC11.1(SH/!LD) IC23.12(RCK) R36.2
RS/CL: R112.1 SV2.8
S1: IC1.20(RD1/SPP1) IC11.9(QH) R121.1
SCANALOG: IC12BASS.11(SCK) IC13SN.11(SCK) IC14LT.11(SCK) IC15MT.11(SCK) IC16HT.11(SCK) IC17RIM.11(SCK) IC18CLAP.11(SCK) IC19HHATS.11(SCK) IC20CRASH.11(SCK) IC21RIDE.11(SCK) IC22.11(SCK) R37.1
SCDIG1: IC1.22(RD3/SPP3) IC5.11(SCK) IC6.11(SCK) IC7.2(CLK) IC8.2(CLK) IC9.2(CLK) IC10.2(CLK) IC11.2(CLK) IC23.11(SCK) R37.2
SD: R106.1 SV1.4
Unconnected: ENC1.4(D) ENC1.5(E) ENC2.4(D) ENC2.5(E) IC1.3(RA1/AN1) IC1.4(RA2/AN2/VREF-/CVREF) IC1.5(RA3/AN3/VREF+) IC1.7(RA5/AN4/!SS!/HLVDIN/C2OUT) IC1.8(RE0/AN5/CK1SPP) IC1.9(RE1/AN6/CK2SPP) IC1.10(RE2/AN7/OESPP) IC1.15(RC0/TIOSO/T13CKI) IC1.16(RC1/T1OSI/ICCP2/!UOE) IC1.17(RC2/CCP1/P1A) IC1.18(VUSB) IC1.23(RC4/D-/VM) IC1.24(RC5/D+/VP) IC1.27(RD4/SPP4) IC7.7(!QH) IC8.7(!QH) IC9.7(!QH) IC10.7(!QH) IC11.7(!QH) IC22.9(QH*) POT1SWING.M1 POT1SWING.M2 S1.2(S1) S1.3(P) S2.2(S1) S2.3(P) S3.2(S1) S3.3(P) S4.2(S1) S4.3(P) S5.1(S) S5.4(P1) S6.1(S) S6.4(P1) S7.1(S) S7.4(P1) S8.1(S) S8.4(P1) S9.2(S1) S9.3(P) S10.2(S1) S10.3(P) S11.2(S1) S11.3(P) S12.2(S1) S12.3(P) S13.1(S) S13.4(P1) S14.1(S) S14.4(P1) S15.1(S) S15.4(P1) S16.1(S) S16.4(P1) S17LIVE.2(S1) S17LIVE.3(P) S18RWD.2(S1) S18RWD.3(P) S19FWD.2(S1) S19FWD.3(P) S20STOP.2(S1) S20STOP.3(P) S21PLAY.1(S) S21PLAY.4(P1) S22SHIFT.1(S) S22SHIFT.4(P1) S23ALT.1(S) S23ALT.4(P1) S24MUTE.2(S1) S24MUTE.3(P) S25PATTERN.2(S1) S25PATTERN.3(P) S26SONG.2(S1) S26SONG.3(P) S27EDIT.2(S1) S27EDIT.3(P) S28BARA.1(S) S28BARA.4(P1) S29BARB.1(S) S29BARB.4(P1) S30BARC.1(S) S30BARC.4(P1) S31BARD.1(S) S31BARD.4(P1) S32GATE.2(S1) S32GATE.3(P) S33ASSIGN.2(S1) S33ASSIGN.3(P)

## Notes on the sheet
- DOUT TRIG/VEL
- DOUT LEDS
- DIN

## Library data of the parts
B1 = rectifier:RB1A: RECTIFIER 1 A
BRIGHTNESS CONTRAST = pot:TRIM_US-: POTENTIOMETER
C1-C4 = gm-caps-ceramic:050X030_025: 47 - 120pF Xicon Ceramic Disc 2.5mm lead spacing
C5-C23 C27 C28 = rcl:C-US: CAPACITOR, American symbol
C25 C26 = rcl:CPOL-US: POLARIZED CAPACITOR, American symbol
D1 = gm-diodes:1N4148: Fast Switching Diode DO-35 glass case a.k.a. 1N914
DIS1 = display-lcd:TUXGR_16X2_R2: Tuxgraphics LCD display 16x2 characters reflective, without background light Source: tuxgr_12x2_r2.pdf
ENC1 ENC2 = myencoder:808_SNAPIN-ENCODER2
H1 H2 H5 H8 H14 = holes:MOUNT-HOLE: MOUNTING HOLE with drill center marker
IC1 = microchip:PIC18F4*_40: USB Microcontrollers with nanoWatt Technology High-Performance, Enhanced Flash, 28/40/44-Pin, Source: http://ww1.microchip.com/downloads/en/devicedoc/39632c.pdf
IC2 IC3 = microchip:24C*: Serial EEPROM 1 K/2 K/4 K
IC4 = v-reg:78XXS: VOLTAGE REGULATOR
IC5 IC6 IC12BASS IC13SN IC14LT IC15MT IC16HT IC17RIM IC18CLAP IC19HHATS IC20CRASH IC21RIDE IC22 IC23 = 74xx-eu:74*595: 8-bit SHIFT REGISTER, output latch
IC7-IC11 = 74xx-eu:74*165: 8-bit parallel load SHIFT REGISTER
IC25 = optocoupler:6N138: MOTOROLA OPTO COUPLER
LED1-LED28 LED33 LED34 = gm-diodes:LED
MIDIIN = con-molex:22-23-2021: .100" (2.54mm) Center Header - 2 Pin
MIDIOUT = con-molex:22-23-2031: .100" (2.54mm) Center Header - 3 Pin
POT1SWING = mainboard:303PARTS_POT
Q1 = crystal:CRYSTAL: CRYSTAL
R1-R132 = gm-resistors:6MM: 6mm Resistors Leads spaced 1-6 holes apart for 0.1" perfboard. Suitable for 1/4 watt resistors.
RN1-RN5 = resistor-sil:G08R: SIL RESISTOR
S1-S16 S17LIVE S18RWD S19FWD S20STOP S21PLAY S22SHIFT S23ALT S24MUTE S25PATTERN S26SONG S27EDIT S28BARA S29BARB S30BARC S31BARD S32GATE S33ASSIGN = mainboard:SWITCH-OMRON_40-XX: OMRON SWITCH
SV1-SV3 = con-lstb:MA05-2: PIN HEADER
T1 = transistor:*-NPN-: NPN Transistror BF959 corrected 2008.03.06
X2 = con-molex:KK-156-2: KK 156 HEADER Source: http://www.molex.com/pdm_docs/sd/026604100_sd.pdf

## Net classes
1 gnd: width 0.508 mm
2 5V: width 0.508 mm